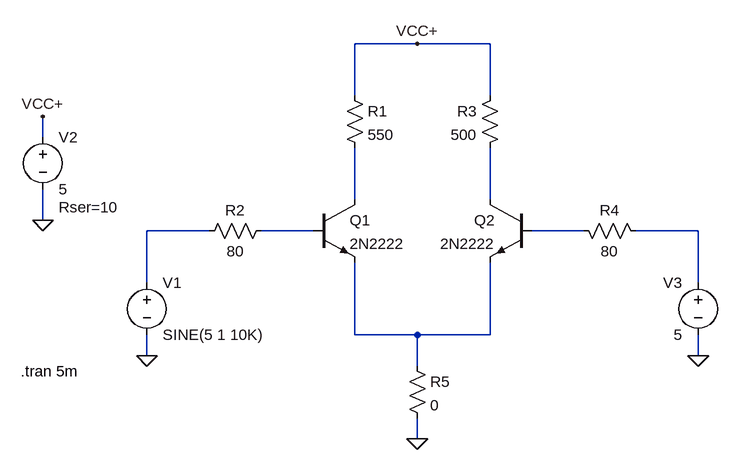
[diagram p0: schematic differential.asc]
differential.asc, the LTspice schematic file:
Version 4
SHEET 1 880 680
WIRE 256 -112 160 -112
WIRE 368 -112 256 -112
WIRE 160 -32 160 -112
WIRE 368 -32 368 -112
WIRE -320 32 -320 0
WIRE 160 128 160 48
WIRE 368 128 368 48
WIRE -320 160 -320 112
WIRE -64 176 -160 176
WIRE 96 176 16 176
WIRE 512 176 432 176
WIRE 688 176 592 176
WIRE -160 256 -160 176
WIRE 688 256 688 176
WIRE 160 336 160 224
WIRE 256 336 160 336
WIRE 368 336 368 224
WIRE 368 336 256 336
WIRE -160 368 -160 336
WIRE 688 368 688 336
WIRE 256 384 256 336
WIRE 256 496 256 464
FLAG -160 368 0
FLAG -320 160 0
FLAG 256 496 0
FLAG 688 368 0
FLAG -320 0 VCC+
FLAG 256 -112 VCC+
SYMBOL npn 96 128 R0
SYMATTR InstName Q1
SYMATTR Value 2N2222
SYMBOL res 144 -48 R0
SYMATTR InstName R1
SYMATTR Value 550
SYMBOL res 32 160 R90
WINDOW 0 0 56 VBottom 2
WINDOW 3 32 56 VTop 2
SYMATTR InstName R2
SYMATTR Value 80
SYMBOL voltage -160 240 R0
WINDOW 123 0 0 Left 0
WINDOW 39 0 0 Left 0
SYMATTR InstName V1
SYMATTR Value SINE(5 1 10K)
SYMBOL voltage -320 16 R0
WINDOW 123 0 0 Left 0
WINDOW 39 24 124 Left 2
SYMATTR InstName V2
SYMATTR Value 5
SYMATTR SpiceLine Rser=10
SYMBOL npn 432 128 M0
SYMATTR InstName Q2
SYMATTR Value 2N2222
SYMBOL res 384 -48 M0
SYMATTR InstName R3
SYMATTR Value 500
SYMBOL res 496 160 M90
WINDOW 0 0 56 VBottom 2
WINDOW 3 32 56 VTop 2
SYMATTR InstName R4
SYMATTR Value 80
SYMBOL voltage 688 240 M0
WINDOW 123 0 0 Left 0
WINDOW 39 0 0 Left 0
SYMATTR InstName V3
SYMATTR Value 5
SYMBOL res 240 368 R0
SYMATTR InstName R5
SYMATTR Value 0
TEXT -354 392 Left 2 !.tran 5m

The netlist it stands for:
* differential.asc
Q1 N001 N004 N007 0 2N2222
R1 VCC+ N001 550
R2 N004 N003 80
V1 N003 0 SINE(5 1 10K)
V2 VCC+ 0 5 Rser=10
Q2 N002 N005 N007 0 2N2222
R3 VCC+ N002 500
R4 N005 N006 80
V3 N006 0 5
R5 N007 0 0
.model NPN NPN
.model PNP PNP
.lib standard.bjt
.tran 5m
.backanno
.end